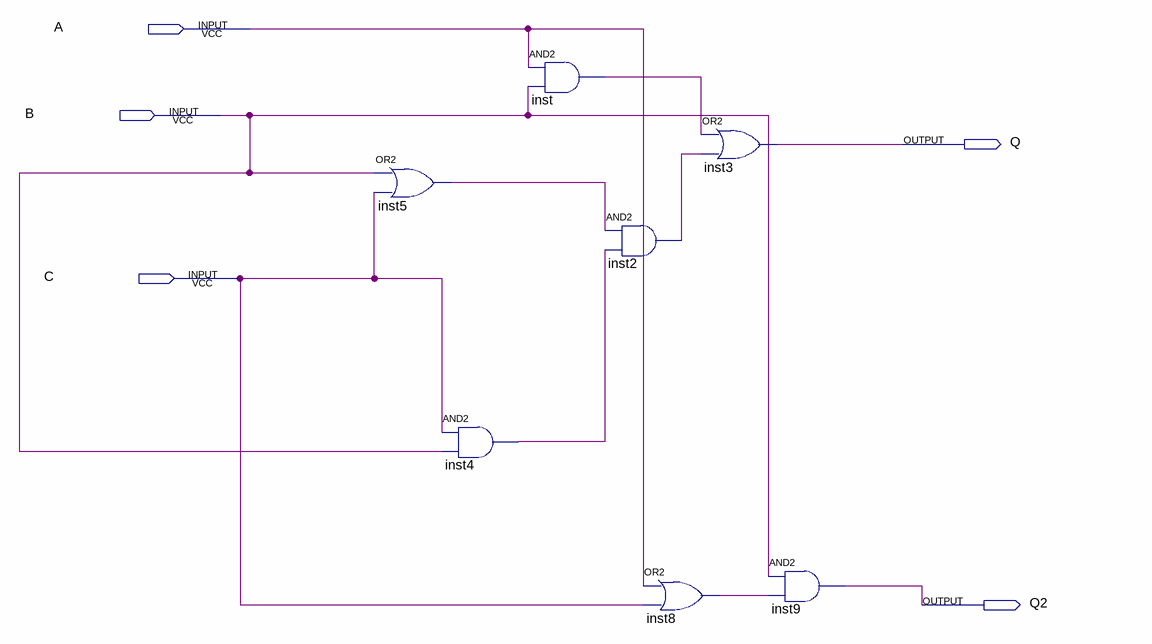
[diagram p0: schematic sheet]
// Quartus schematic aula01.bdf as structural Verilog: 7 symbols, 5 pins
module aula01 (
  input  A,
  input  B,
  input  C,
  output Q,
  output Q2
);

  wire inst2_out, inst4_out, inst5_out, inst8_out, inst_out;

  or inst5 (inst5_out, B, C);
  and inst4 (inst4_out, C, B);
  and inst (inst_out, A, B);
  and inst2 (inst2_out, inst5_out, inst4_out);
  or inst8 (inst8_out, A, C);
  or inst3 (Q, inst_out, inst2_out);
  and inst9 (Q2, B, inst8_out);
endmodule
